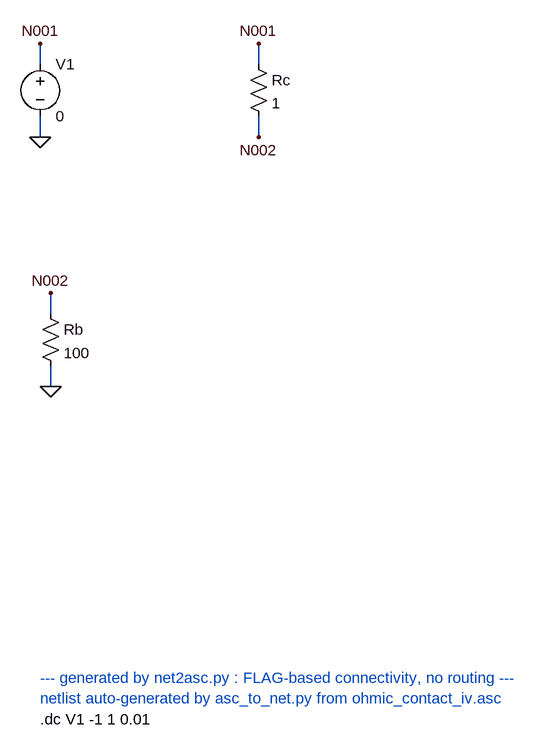
[diagram p0: schematic ohmic_contact_iv.asc]
ohmic_contact_iv.asc, the LTspice schematic file:
Version 4
SHEET 1 880 1224
WIRE 0 16 0 -16
WIRE 0 96 0 128
WIRE 336 16 336 -16
WIRE 336 96 336 128
WIRE 16 400 16 368
WIRE 16 480 16 512
FLAG 0 -16 N001
FLAG 0 128 0
FLAG 336 -16 N001
FLAG 336 128 N002
FLAG 16 368 N002
FLAG 16 512 0
SYMBOL voltage 0 0 R0
SYMATTR InstName V1
SYMATTR Value 0
SYMBOL res 320 0 R0
SYMATTR InstName Rc
SYMATTR Value 1
SYMBOL res 0 384 R0
SYMATTR InstName Rb
SYMATTR Value 100
TEXT 0 960 Left 2 ;--- generated by net2asc.py : FLAG-based connectivity, no routing ---
TEXT 0 992 Left 2 ;netlist auto-generated by asc_to_net.py from ohmic_contact_iv.asc
TEXT 0 1024 Left 2 !.dc V1 -1 1 0.01

The netlist it stands for:
* ohmic_contact_iv.asc
V1 N001 0 0
Rc N001 N002 1
Rb N002 0 100
* --- generated by net2asc.py : FLAG-based connectivity, no routing ---
* netlist auto-generated by asc_to_net.py from ohmic_contact_iv.asc
.dc V1 -1 1 0.01
.backanno
.end